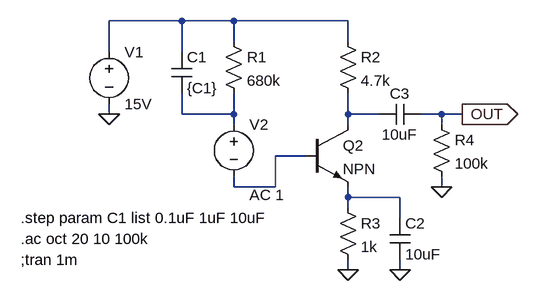
[diagram p0: schematic Noise Generator_analysis_AC.asc]
Noise Generator_analysis_AC.asc, the LTspice schematic file:
Version 4
SHEET 1 880 680
WIRE 80 -32 -32 -32
WIRE 160 -32 80 -32
WIRE 336 -32 160 -32
WIRE 160 0 160 -32
WIRE 336 0 336 -32
WIRE -32 16 -32 -32
WIRE 80 16 80 -32
WIRE -32 112 -32 96
WIRE 80 112 80 80
WIRE 160 112 160 80
WIRE 160 112 80 112
WIRE 336 112 336 80
WIRE 384 112 336 112
WIRE 480 112 448 112
WIRE 512 112 480 112
WIRE 160 128 160 112
WIRE 336 128 336 112
WIRE 480 128 480 112
WIRE 272 176 224 176
WIRE 160 224 160 208
WIRE 224 224 224 176
WIRE 224 224 160 224
WIRE 480 224 480 208
WIRE 336 240 336 224
WIRE 416 240 336 240
WIRE 336 256 336 240
WIRE 416 272 416 240
WIRE 336 352 336 336
WIRE 416 352 416 336
FLAG 336 352 0
FLAG 416 352 0
FLAG 512 112 OUT
IOPIN 512 112 Out
FLAG -32 112 0
FLAG 480 224 0
SYMBOL res 144 -16 R0
SYMATTR InstName R1
SYMATTR Value 680k
SYMBOL cap 64 16 R0
SYMATTR InstName C1
SYMATTR Value {C1}
SYMBOL npn 272 128 R0
SYMATTR InstName Q2
SYMBOL res 320 -16 R0
SYMATTR InstName R2
SYMATTR Value 4.7k
SYMBOL res 320 240 R0
SYMATTR InstName R3
SYMATTR Value 1k
SYMBOL cap 400 272 R0
SYMATTR InstName C2
SYMATTR Value 10uF
SYMBOL voltage -32 0 R0
WINDOW 123 0 0 Left 2
WINDOW 39 0 0 Left 2
SYMATTR InstName V1
SYMATTR Value 15V
SYMBOL cap 448 96 R90
WINDOW 0 0 32 VBottom 2
WINDOW 3 32 32 VTop 2
SYMATTR InstName C3
SYMATTR Value 10uF
SYMBOL res 464 112 R0
SYMATTR InstName R4
SYMATTR Value 100k
SYMBOL voltage 160 112 R0
WINDOW 123 24 124 Left 2
WINDOW 39 0 0 Left 2
SYMATTR InstName V2
SYMATTR Value ""
SYMATTR Value2 AC 1
TEXT -168 336 Left 2 !;tran 1m
TEXT -168 304 Left 2 !.ac oct 20 10 100k
TEXT -168 272 Left 2 !.step param C1 list 0.1uF 1uF 10uF

The netlist it stands for:
* Noise Generator_analysis_AC.asc
R1 N001 N002 680k
C1 N001 N002 {C1}
Q2 N003 N004 N005 0 NPN
R2 N001 N003 4.7k
R3 N005 0 1k
C2 N005 0 10uF
V1 N001 0 15V
C3 OUT N003 10uF
R4 OUT 0 100k
V2 N002 N004 AC 1
.model NPN NPN
.model PNP PNP
.lib standard.bjt
;tran 1m
.ac oct 20 10 100k
.step param C1 list 0.1uF 1uF 10uF
.backanno
.end